# EAGLE schematic Talos_v39 (EAGLE 9.7.0)
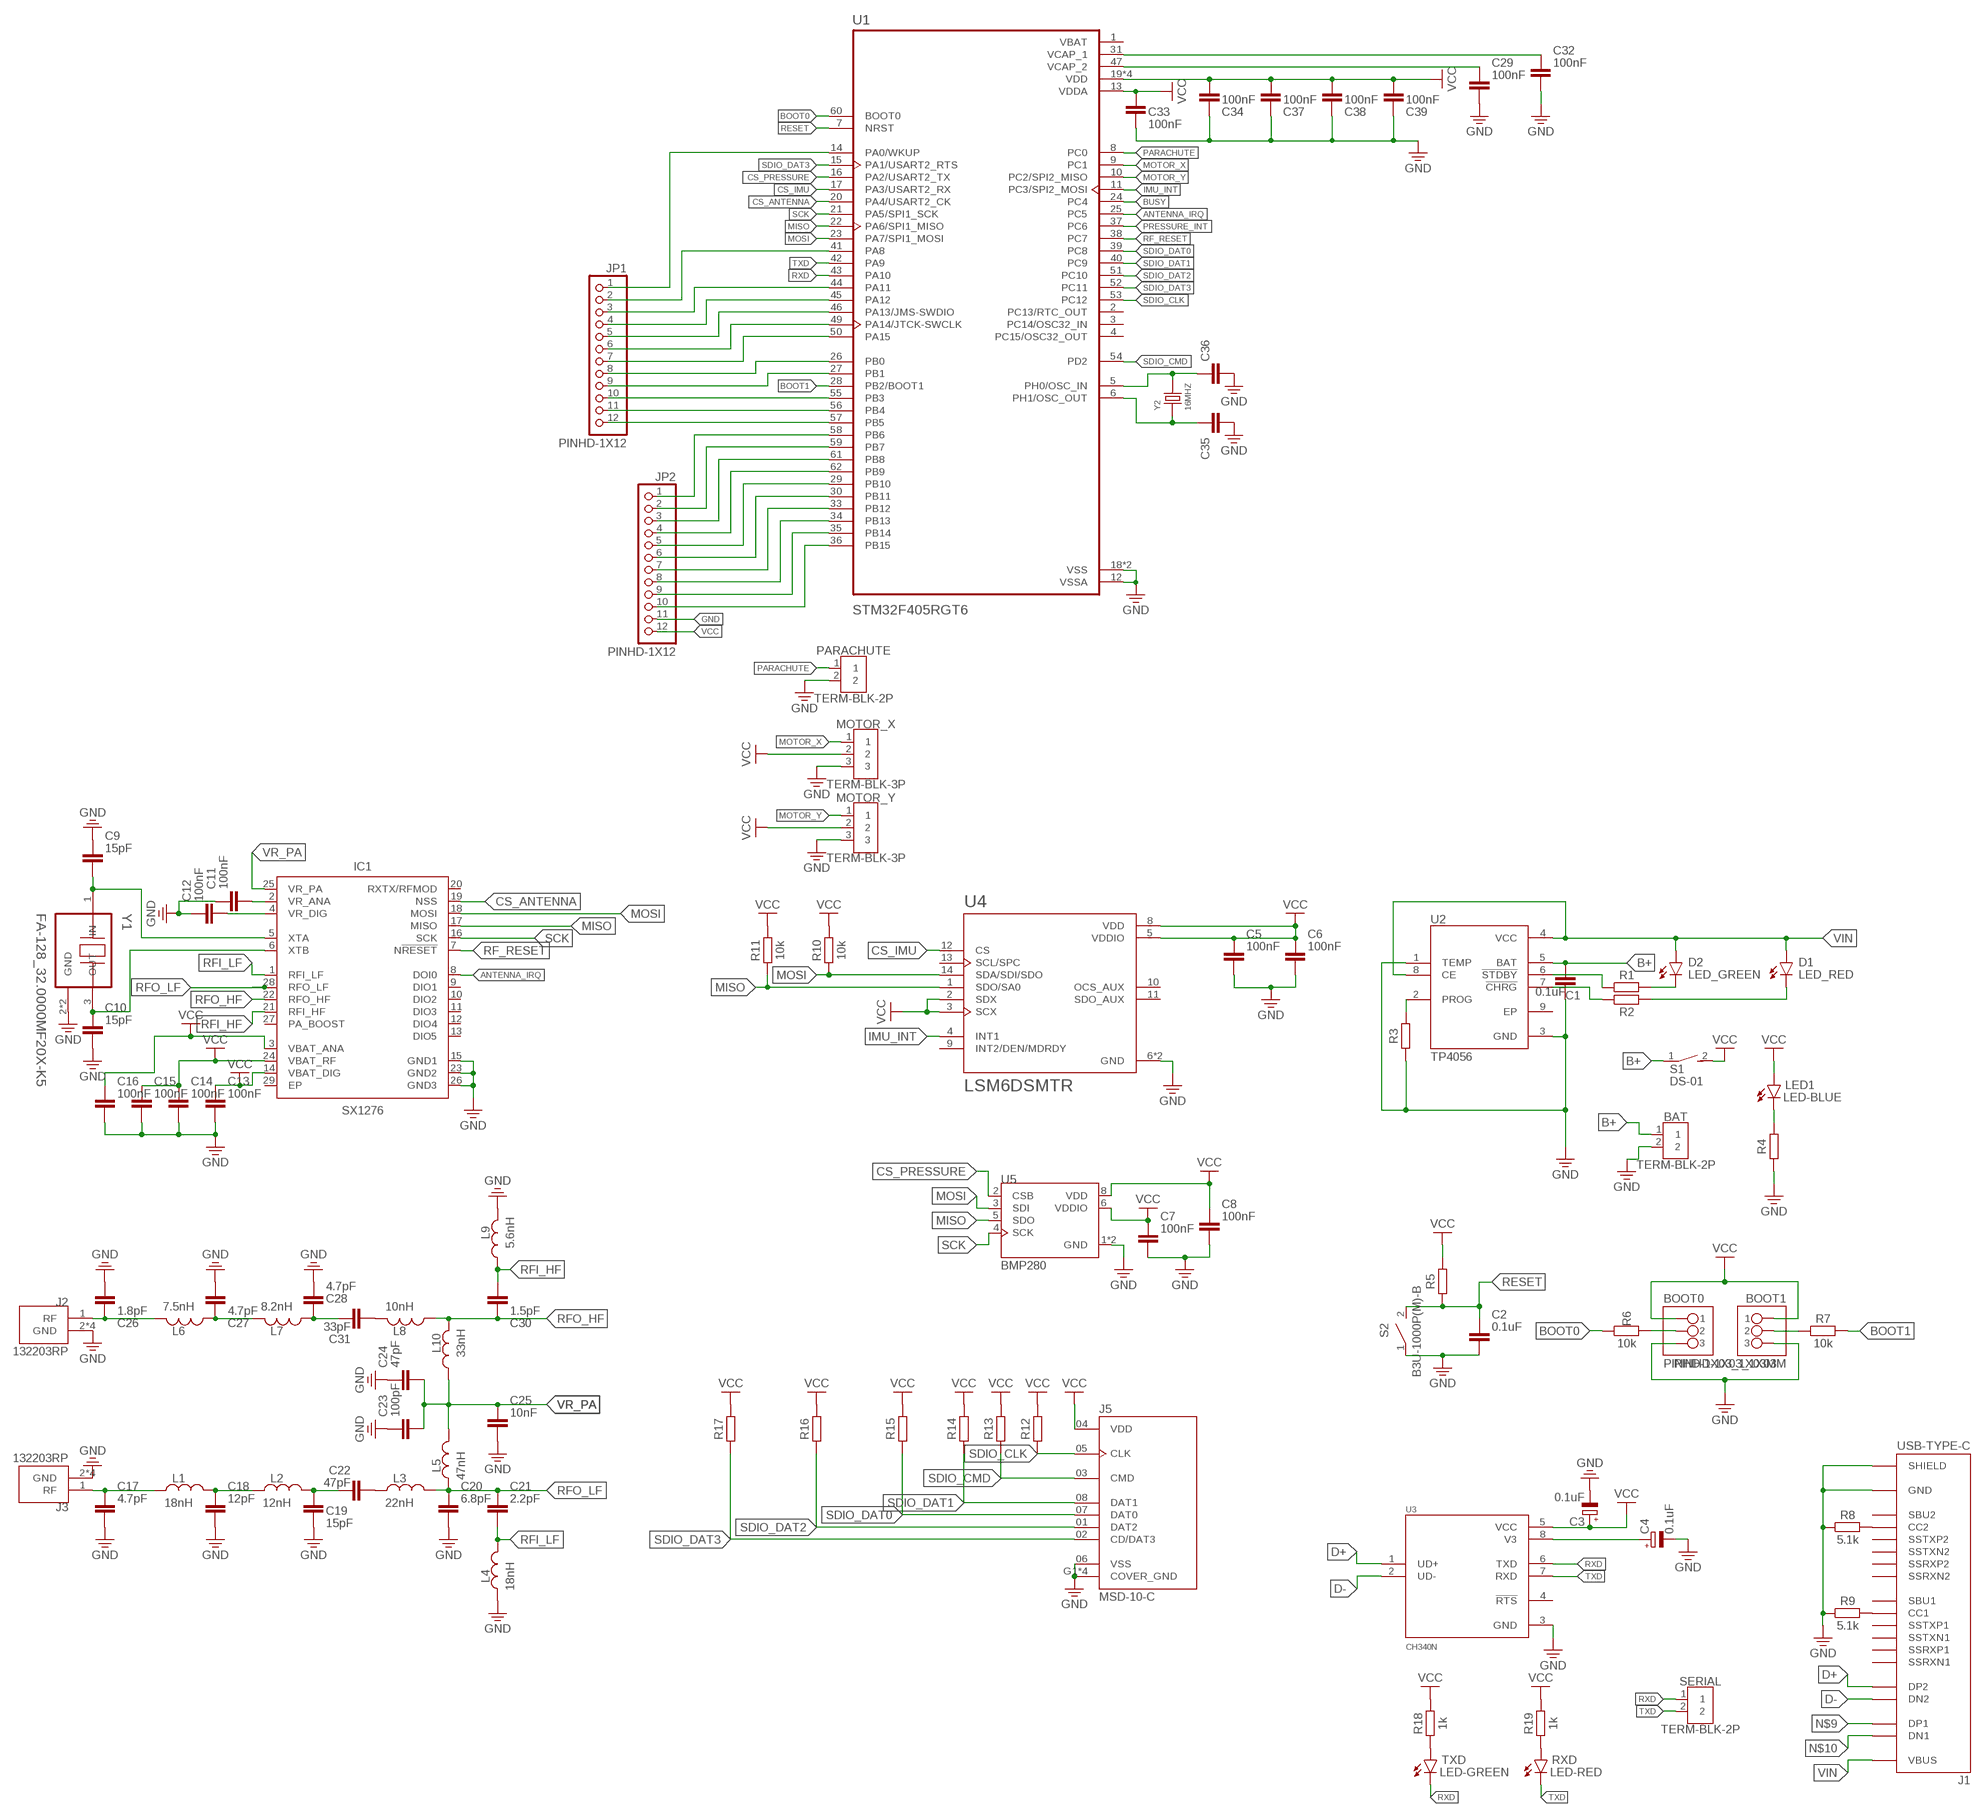
[diagram p0: schematic, sheet 1]

## Parts
BAT  TERM-BLK-2P  2828XX-2282834-2  [TERMBLK_254-2N]
BOOT0  PINHD-1X03_1X03M  [1X03]
BOOT1  PINHD-1X03_1X03M  [1X03]
C1  0.1uF  C_CHIP-0402(1005-METRIC)  [CAPC1005X60]
C2  0.1uF  C_CHIP-0402(1005-METRIC)  [CAPC1005X60]
C3  0.1uF  C-POL_TANTALUM-1206(3216-METRIC)  [CAPMP3216X180N]
C4  0.1uF  C-POL_TANTALUM-1206(3216-METRIC)  [CAPMP3216X180N]
C5  100nF  C_CHIP-0402(1005-METRIC)  [CAPC1005X60]
C6  100nF  C_CHIP-0402(1005-METRIC)  [CAPC1005X60]
C7  100nF  C_CHIP-0402(1005-METRIC)  [CAPC1005X60]
C8  100nF  C_CHIP-0402(1005-METRIC)  [CAPC1005X60]
C9  15pF  C_CHIP-0402(1005-METRIC)  [CAPC1005X60]
C10  15pF  C_CHIP-0402(1005-METRIC)  [CAPC1005X60]
C11  100nF  C_CHIP-0402(1005-METRIC)  [CAPC1005X60]
C12  100nF  C_CHIP-0402(1005-METRIC)  [CAPC1005X60]
C13  100nF  C_CHIP-0402(1005-METRIC)  [CAPC1005X60]
C14  100nF  C_CHIP-0402(1005-METRIC)  [CAPC1005X60]
C15  100nF  C_CHIP-0402(1005-METRIC)  [CAPC1005X60]
C16  100nF  C_CHIP-0402(1005-METRIC)  [CAPC1005X60]
C17  4.7pF  C_CHIP-0402(1005-METRIC)  [CAPC1005X60]
C18  12pF  C_CHIP-0402(1005-METRIC)  [CAPC1005X60]
C19  15pF  C_CHIP-0402(1005-METRIC)  [CAPC1005X60]
C20  6.8pF  C_CHIP-0402(1005-METRIC)  [CAPC1005X60]
C21  2.2pF  C_CHIP-0402(1005-METRIC)  [CAPC1005X60]
C22  47pF  C_CHIP-0402(1005-METRIC)  [CAPC1005X60]
C23  100pF  C_CHIP-0402(1005-METRIC)  [CAPC1005X60]
C24  47pF  C_CHIP-0402(1005-METRIC)  [CAPC1005X60]
C25  10nF  C_CHIP-0402(1005-METRIC)  [CAPC1005X60]
C26  1.8pF  C_CHIP-0402(1005-METRIC)  [CAPC1005X60]
C27  4.7pF  C_CHIP-0402(1005-METRIC)  [CAPC1005X60]
C28  4.7pF  C_CHIP-0402(1005-METRIC)  [CAPC1005X60]
C29  100nF  C_CHIP-0402(1005-METRIC)  [CAPC1005X60]
C30  1.5pF  C_CHIP-0402(1005-METRIC)  [CAPC1005X60]
C31  33pF  C_CHIP-0402(1005-METRIC)  [CAPC1005X60]
C32  100nF  C_CHIP-0402(1005-METRIC)  [CAPC1005X60]
C33  100nF  C_CHIP-0402(1005-METRIC)  [CAPC1005X60]
C34  100nF  C_CHIP-0402(1005-METRIC)  [CAPC1005X60]
C35  C_CHIP-0402(1005-METRIC)  [CAPC1005X60]
C36  C_CHIP-0402(1005-METRIC)  [CAPC1005X60]
C37  100nF  C_CHIP-0402(1005-METRIC)  [CAPC1005X60]
C38  100nF  C_CHIP-0402(1005-METRIC)  [CAPC1005X60]
C39  100nF  C_CHIP-0402(1005-METRIC)  [CAPC1005X60]
D1  LED_RED  CHIP-FLAT-R_0603-0.35MM  [LEDC1608X35N_FLAT-R]
D2  LED_GREEN  CHIP-FLAT-G_0603-0.35MM  [LEDC1608X35N_FLAT-G]
IC1  SX1276  [QFN65P600X600X100-29T480]
J1  USB-TYPE-C  [CUI_UJ31-CH-31-SMT-TR]
J2  132203RP  [132203RP]
J3  132203RP  [132203RP]
J5  MSD-10-C  [CUI_MSD-10-C]
JP1  PINHD-1X12  [1X12]
JP2  PINHD-1X12  [1X12]
L1  18nH  L_CHIP-0402(1006-METRIC)  [INDC1006X60N]
L2  12nH  L_CHIP-0402(1006-METRIC)  [INDC1006X60N]
L3  22nH  L_CHIP-0402(1006-METRIC)  [INDC1006X60N]
L4  18nH  L_CHIP-0402(1006-METRIC)  [INDC1006X60N]
L5  47nH  L_CHIP-0402(1006-METRIC)  [INDC1006X60N]
L6  7.5nH  L_CHIP-0402(1006-METRIC)  [INDC1006X60N]
L7  8.2nH  L_CHIP-0402(1006-METRIC)  [INDC1006X60N]
L8  10nH  L_CHIP-0402(1006-METRIC)  [INDC1006X60N]
L9  5.6nH  L_CHIP-0402(1006-METRIC)  [INDC1006X60N]
L10  33nH  L_CHIP-0402(1006-METRIC)  [INDC1006X60N]
LED1  LED-BLUE  LED_CHIP_BLUE-1608  [LEDC1608X39N_B]
MOTOR_X  TERM-BLK-3P  2828XX-3282834-3  [TERMBLK_254-3N]
MOTOR_Y  TERM-BLK-3P  2828XX-3282834-3  [TERMBLK_254-3N]
PARACHUTE  TERM-BLK-2P  2828XX-2282834-2  [TERMBLK_254-2N]
R1  R_CHIP-0402(1005-METRIC)  [RESC1005X40]
R2  R_CHIP-0402(1005-METRIC)  [RESC1005X40]
R3  RESISTOR__CHIP-0402(1005-METRIC)  [RESC1005X40]
R4  R_CHIP-0402(1005-METRIC)  [RESC1005X40]
R5  R_CHIP-0402(1005-METRIC)  [RESC1005X40]
R6  10k  R_CHIP-0402(1005-METRIC)  [RESC1005X40]
R7  10k  R_CHIP-0402(1005-METRIC)  [RESC1005X40]
R8  5.1k  R_CHIP-0402(1005-METRIC)  [RESC1005X40]
R9  5.1k  R_CHIP-0402(1005-METRIC)  [RESC1005X40]
R10  10k  R_CHIP-0402(1005-METRIC)  [RESC1005X40]
R11  10k  R_CHIP-0402(1005-METRIC)  [RESC1005X40]
R12  R_CHIP-0402(1005-METRIC)  [RESC1005X40]
R13  R_CHIP-0402(1005-METRIC)  [RESC1005X40]
R14  R_CHIP-0402(1005-METRIC)  [RESC1005X40]
R15  R_CHIP-0402(1005-METRIC)  [RESC1005X40]
R16  R_CHIP-0402(1005-METRIC)  [RESC1005X40]
R17  R_CHIP-0402(1005-METRIC)  [RESC1005X40]
R18  1k  R_CHIP-0402(1005-METRIC)  [RESC1005X40]
R19  1k  R_CHIP-0402(1005-METRIC)  [RESC1005X40]
RXD  LED-RED  LED_CHIP_RED-1608  [LEDC1608X39N_R]
S1  DS-01  DS01E  [DS-01]
S2  B3U-1000P(M)-B  B3U-X000B3U-1000P(M)-B1000P(M)-B  [B3U-1000P(M)-B]
SERIAL  TERM-BLK-2P  2828XX-2282834-2  [TERMBLK_254-2N]
TXD  LED-GREEN  LED_CHIP_GREEN-1608  [LEDC1608X39N_G]
U1  STM32F405RGT6  [QFP50P1200X1200X160-64N]
U2  TP4056  [SOP127P600X175-9N]
U3  CH340N  [SOIC127P600X160-8N]
U4  LSM6DSMTR  [PQFN50P300X250X86-14N]
U5  BMP280  [XDCR_BMP280]
Y1  FA-128_32.0000MF20X-K5  [OSCCC200X160X50]
Y2  16MHZ  DIP-CRYSTAL-16MHZ-18PF-30PPM-40R(HC49US)  [HC49US]

## Nets
ANTENNA_IRQ: IC1.8(DOI0) U1.25(PC5)
B+: BAT.1 C1.2 S1.1 U2.5(BAT)
BOOT0: R6.1 U1.60(BOOT0)
BOOT1: R7.2 U1.28(PB2/BOOT1)
BUSY: U1.24(PC4)
CS_ANTENNA: IC1.19(NSS) U1.20(PA4/USART2_CK)
CS_IMU: U1.17(PA3/USART2_RX) U4.12(CS)
CS_PRESSURE: U1.16(PA2/USART2_TX) U5.2(CSB)
D+: J1.B6(DP2) U3.1(UD+)
D-: J1.B7(DN2) U3.2(UD-)
GND: BAT.2 BOOT0.3 BOOT1.3 C1.1 C2.2 C3.2(-) C4.2(-) C5.2 C6.2 C7.2 C8.2 C9.1 C10.2 C11.1 C12.1 C13.2 C14.2 C15.2 C16.2 C17.2 C18.2 C19.2 C20.2 C23.1 C24.1 C25.2 C26.2 C27.2 C28.2 C29.2 C32.2 C33.2 C34.2 C35.2 C36.2 C37.2 C38.2 C39.2 IC1.15(GND1) IC1.23(GND2) IC1.26(GND3) J1.1(SHIELD) J1.2(SHIELD) J1.3(SHIELD) J1.4(SHIELD) J1.5(SHIELD) J1.6(SHIELD) J1.A1(GND) J1.A12(GND) J1.B1(GND) J1.B12(GND) J1.S1(SHIELD) J1.S2(SHIELD) J2.2(GND) J2.3(GND) J2.4(GND) J2.5(GND) J3.2(GND) J3.3(GND) J3.4(GND) J3.5(GND) J5.06(VSS) J5.G1(COVER_GND) J5.G2(COVER_GND) J5.G3(COVER_GND) J5.G4(COVER_GND) JP2.11 L4.1 L9.1 MOTOR_X.3 MOTOR_Y.3 PARACHUTE.2 R3.1 R4.1 R8.1 R9.1 S2.1 U1.12(VSSA) U1.18(VSS) U1.63(VSS) U2.1(TEMP) U2.3(GND) U3.3(GND) U4.6(GND) U4.7(GND) U5.1(GND) U5.7(GND) Y1.2(GND) Y1.4(GND)
IMU_INT: U1.11(PC3/SPI2_MOSI) U4.4(INT1)
MISO: IC1.17(MISO) R11.1 U1.22(PA6/SPI1_MISO) U4.1(SDO/SA0) U5.5(SDO)
MOSI: IC1.18(MOSI) R10.1 U1.23(PA7/SPI1_MOSI) U4.14(SDA/SDI/SDO) U5.3(SDI)
MOTOR_X: MOTOR_X.1 U1.9(PC1)
MOTOR_Y: MOTOR_Y.1 U1.10(PC2/SPI2_MISO)
N$1: D2.C R1.2
N$2: D1.C R2.2
N$3: R1.1 U2.6(!STDBY)
N$4: R2.1 U2.7(!CHRG)
N$5: R3.2 U2.2(PROG)
N$6: LED1.1(C) R4.2
N$7: BOOT0.2 R6.2
N$8: BOOT1.2 R7.1
N$9: J1.A6(DP1)
N$10: J1.A7(DN1)
N$11: J1.B5(CC2) R8.2
N$12: C4.1(+) U3.8(V3)
N$13: J1.A5(CC1) R9.2
N$14: JP1.1 U1.14(PA0/WKUP)
N$15: JP1.2 U1.41(PA8)
N$16: C9.2 IC1.5(XTA) Y1.1(IN)
N$17: C10.1 IC1.6(XTB) Y1.3(OUT)
N$18: C11.2 IC1.2(VR_ANA)
N$19: C12.2 IC1.4(VR_DIG)
N$20: C17.1 J3.1(RF) L1.1
N$21: C18.1 L1.2 L2.1
N$22: C19.1 C22.1 L2.2
N$23: C26.1 J2.1(RF) L6.1
N$24: C27.1 L6.2 L7.1
N$25: C22.2 L3.1
N$26: C28.1 C31.1 L7.2
N$27: C31.2 L8.1
N$28: C32.1 U1.31(VCAP_1)
N$29: C29.1 U1.47(VCAP_2)
N$30: JP1.3 U1.44(PA11)
N$31: JP1.4 U1.45(PA12)
N$32: JP1.5 U1.46(PA13/JMS-SWDIO)
N$33: JP1.6 U1.49(PA14/JTCK-SWCLK)
N$34: JP1.7 U1.50(PA15)
N$35: JP1.8 U1.26(PB0)
N$36: JP1.9 U1.27(PB1)
N$37: JP1.10 U1.55(PB3)
N$38: JP1.11 U1.56(PB4)
N$39: JP1.12 U1.57(PB5)
N$40: JP2.1 U1.58(PB6)
N$41: JP2.2 U1.59(PB7)
N$42: JP2.3 U1.61(PB8)
N$43: JP2.4 U1.62(PB9)
N$44: JP2.5 U1.29(PB10)
N$45: JP2.6 U1.30(PB11)
N$46: JP2.7 U1.33(PB12)
N$47: JP2.8 U1.34(PB13)
N$48: JP2.9 U1.35(PB14)
N$49: JP2.10 U1.36(PB15)
N$50: R19.1 RXD.2(A)
N$51: R18.1 TXD.2(A)
OSC_IN: C36.1 U1.5(PH0/OSC_IN) Y2.2
OSC_OUT: C35.1 U1.6(PH1/OSC_OUT) Y2.1
PARACHUTE: PARACHUTE.1 U1.8(PC0)
PRESSURE_INT: U1.37(PC6)
RESET: C2.1 R5.1 S2.2 U1.7(NRST)
RF_RESET: IC1.7(N!RESET!) U1.38(PC7)
RFI_HF: C30.2 IC1.21(RFI_HF) L9.2
RFI_LF: C21.2 IC1.1(RFI_LF) L4.2
RFO_HF: C30.1 IC1.22(RFO_HF) L8.2 L10.1
RFO_LF: C20.1 C21.1 IC1.28(RFO_LF) L3.2 L5.1
RXD: SERIAL.1 TXD.1(C) U1.43(PA10) U3.6(TXD)
SCK: IC1.16(SCK) U1.21(PA5/SPI1_SCK) U5.4(SCK)
SDIO_CLK: J5.05(CLK) R12.1 U1.53(PC12)
SDIO_CMD: J5.03(CMD) R13.1 U1.54(PD2)
SDIO_DAT0: J5.07(DAT0) R15.1 U1.39(PC8)
SDIO_DAT1: J5.08(DAT1) R14.1 U1.40(PC9)
SDIO_DAT2: J5.01(DAT2) R16.1 U1.51(PC10)
SDIO_DAT3: J5.02(CD/DAT3) R17.1 U1.15(PA1/USART2_RTS) U1.52(PC11)
TXD: RXD.1(C) SERIAL.2 U1.42(PA9) U3.7(RXD)
VCC: BOOT0.1 BOOT1.1 C3.1(+) C5.1 C6.1 C7.1 C8.1 C13.1 C14.1 C15.1 C16.1 C33.1 C34.1 C37.1 C38.1 C39.1 IC1.3(VBAT_ANA) IC1.14(VBAT_DIG) IC1.24(VBAT_RF) J5.04(VDD) JP2.12 LED1.2(A) MOTOR_X.2 MOTOR_Y.2 R5.2 R10.2 R11.2 R12.2 R13.2 R14.2 R15.2 R16.2 R17.2 R18.2 R19.2 S1.2 U1.13(VDDA) U1.19(VDD) U1.32(VDD) U1.48(VDD) U1.64(VDD) U3.5(VCC) U4.2(SDX) U4.3(SCX) U4.5(VDDIO) U4.8(VDD) U5.6(VDDIO) U5.8(VDD)
VIN: D1.A D2.A J1.A4(VBUS) J1.A9(VBUS) J1.B4(VBUS) J1.B9(VBUS) U2.4(VCC) U2.8(CE)
VR_PA: C23.2 C24.2 C25.1 IC1.25(VR_PA) L5.2 L10.2
Unconnected: IC1.9(DIO1) IC1.10(DIO2) IC1.11(DIO3) IC1.12(DIO4) IC1.13(DIO5) IC1.20(RXTX/RFMOD) IC1.27(PA_BOOST) IC1.29(EP) J1.A2(SSTXP1) J1.A3(SSTXN1) J1.A8(SBU1) J1.A10(SSRXN2) J1.A11(SSRXP2) J1.B2(SSTXP2) J1.B3(SSTXN2) J1.B8(SBU2) J1.B10(SSRXN1) J1.B11(SSRXP1) U1.2(PC13/RTC_OUT) U1.3(PC14/OSC32_IN) U1.4(PC15/OSC32_OUT) U2.9(EP) U3.4(!RTS) U4.9(INT2/DEN/MDRDY) U4.10(OCS_AUX) U4.11(SDO_AUX) U4.13(SCL/SPC)

## Power pins joined to a net without a drawn wire
VBAT: U1.1(VBAT)

## Library data of the parts
BAT PARACHUTE SERIAL = Connector:2828XX-2: 2 Position Wire to Board Terminal Block Horizontal with Board Datasheet <https://www.te.com.cn/commerce/DocumentDelivery/DDEController?Action=showdoc&DocId=Catalog+Section%7F1308389_EUROSTYLE_TERMINAL_BLOCKS%7F0607%7Fpdf%7FEnglish%7FENG_CS_1308389_EUROSTYLE_TERMINAL_BLOCKS_0607.pdf%7F2-282837-5>; CATEGORY: Fixed Terminal Blocks; DESCRIPTION: Fixed Terminal Blocks 2P SIDE ENTRY 2.54mm; MANUFACTURER: TE Connectivity AMP Connectors; MPN: 282834-2; OPERATING_TEMPERATURE: -40°C ~ 105°C; PART_STATUS: Active; PITCH: 0.100" (2.54mm); ROHS_COMPLIANCE: RoHS Compliant; SERIES: Buchanan; SUBCATEGORY: Terminal Blocks; TYPE: Through Hole; Screw - Rising Cage Clamp; Side wire entry, Horizontal with Board
BOOT0 BOOT1 = Tinkercad:PINHD-1X03
C1 C2 C5-C39 = Capacitor:C: Capacitor - Generic; CATEGORY: Capacitor
C3 C4 = Capacitor:C-POL: Capacitor Polarised - Generic; CATEGORY: Capacitor
D1 = LED:CHIP-FLAT-R; CATEGORY: LED; COLOR: RED; DESCRIPTION: CHIP LED FLAT; SUB-CATEGORY: CHIP; TYPE: FLAT_TOP
D2 = LED:CHIP-FLAT-G; CATEGORY: LED; COLOR: GREEN; DESCRIPTION: CHIP LED FLAT; SUB-CATEGORY: CHIP; TYPE: FLAT_TOP
IC1 = IC_Wireless-RF:SX127*: SX1276/77/79 - 137 MHz to 1020 MHz Low Power Long Range Transceiver Datasheet <https://semtech.my.salesforce.com/sfc/p/#E0000000JelG/a/2R0000001Rbr/6EfVZUorrpoKFfvaF_Fkpgp5kzjiNyiAbqcpqh9qSjE> Product Page <https://www.semtech.com/products/wireless-rf/lora-core/sx1276>; CATEGORY: IC_Wireless-RF; DESCRIPTION: IC RF TXRX 802.15.4 28VQFN; FREQUENCY: 137 - 1020 MHz; MANUFACTURER: Semtech; MPN: SX1276IMLTRT; OPERATING_TEMP: -40°C to 85°C; PART_STATUS: Active; SERIES: SX1276; SUB-CATEGORY: Transceiver; TYPE: LoRa Core™
J1 = SnapEDA Library:USB-TYPE-C: Type C, USB 3.1 Gen 2, 5 A, Right Angle, Surface Mount (SMT), USB Receptacle; MANUFACTURER: CUI Devices; MAXIMUM_PACKAGE_HEIGHT: 3.21 mm; PARTREV: 1.03; STANDARD: Manufacturer Recommendations
J2 J3 = SnapEDA Library:132203RP: Conn; RF; SMA Rt Angle PCB Jack Thru Hole 50 Ohm Bulkhead Reverse Polarized; MANUFACTURER: AMPHENOL CONEXX; PARTREV: C; STANDARD: Manufacturer recommendations
J5 = SnapEDA Library:MSD-10-C; MANUFACTURER: CUI Devices; MAXIMUM_PACKAGE_HEIGHT: 2.07mm; PARTREV: 1.0; STANDARD: Manufacturer Recommendations
JP1 JP2 = Connector:PINHD-1X12: PIN HEADER; CATEGORY: Headers; DESCRIPTION: Header, Straight, 12 Position; MANUFACTURER: Generic; MPN: Generic; OPERATING_TEMPERATURE: Generic; PART_STATUS: Active; PITCH: 0.100" (2.54mm); ROHS_COMPLIANCE: Generic; SERIES: Generic; SUB-CATEGORY: Headers, Male Pins; TYPE: Board to Board or Cable, Unshrouded, Through Hole, Straight
L1-L10 = Inductor:L: Inductor Fixed - Generic; CATEGORY: Inductor; SUB-CATEGORY: Fixed
LED1 = Tutorial - Fusion 360:LED_CHIP: LED - Generic; CATEGORY: Opto-Electronic; COLOR: Blue; SUB-CATEGORY: LED
MOTOR_X MOTOR_Y = Connector:2828XX-3: 3 Position Wire to Board Terminal Block Horizontal with Board Datasheet <https://www.te.com.cn/commerce/DocumentDelivery/DDEController?Action=showdoc&DocId=Catalog+Section%7F1308389_EUROSTYLE_TERMINAL_BLOCKS%7F0607%7Fpdf%7FEnglish%7FENG_CS_1308389_EUROSTYLE_TERMINAL_BLOCKS_0607.pdf%7F2-282837-5>; CATEGORY: Fixed Terminal Blocks; DESCRIPTION: Fixed Terminal Blocks 3P TERMINAL BLOCK; MANUFACTURER: TE Connectivity AMP Connectors; MPN: 282834-3; OPERATING_TEMPERATURE: -40°C ~ 105°C; PART_STATUS: Active; PITCH: 0.100" (2.54mm); ROHS_COMPLIANCE: RoHS Compliant; SERIES: Buchanan; SUBCATEGORY: Terminal Blocks; TYPE: Through Hole; Screw - Rising Cage Clamp; Side wire entry, Horizontal with Board
R1 R2 R4-R19 = Resistor:R: Resistor Fixed - Generic; CATEGORY: Resistor; SUB-CATEGORY: Fixed
R3 = Tinkercad:RESISTOR: Resistor Fixed - Generic; CATEGORY: Resistor; SUB-CATEGORY: Fixed
RXD = Tutorial - Fusion 360:LED_CHIP: LED - Generic; CATEGORY: Opto-Electronic; COLOR: Red; SUB-CATEGORY: LED
S1 = Switch:DS01E: DIL/CODE SWITCH; CATEGORY: SWITCH; TYPE: SPST
S2 = Switch:B3U-X000: Ultra-small Tactile Switch Contact form : SPST-NO Datasheet <https://omronfs.omron.com/en_US/ecb/products/pdf/en-b3u.pdf>; CATEGORY: SWITCH; DESCRIPTION: Ultra-small Surface-mounting Tactile Switches with High Contact Reliability; MANUFACTURER: OMRON; OPERATING_TEMPERATURE: -25°C to +70°C at 60%RH max; PART_STATUS: ACTIVE; SERIES: B3U; TYPE: Tactile
TXD = Tutorial - Fusion 360:LED_CHIP: LED - Generic; CATEGORY: Opto-Electronic; COLOR: Green; SUB-CATEGORY: LED
U1 = SnapEDA Library:STM32F405RGT6: High-performance foundation line, ARM Cortex-M4 core with DSP and FPU, 1 Mbyte Flash, 168 MHz CPU, ART Accelerator; MANUFACTURER: STMicroelectronics; PARTREV: LTR; STANDARD: IPC-7351B
U2 = SnapEDA Library:TP4056: Complete single cell Li-Ion battery with a constant current / constant voltage linear charger; MANUFACTURER: NanJing Top Power ASIC Corp.; MAXIMUM_PACKAGE_HEIGHT: 1.75mm; STANDARD: IPC 7351B
U3 = SnapEDA Library:CH340N; MANUFACTURER: WCH; MAXIMUM_PACKAGE_HEIGHT: 1.6mm; PARTREV: V3C; STANDARD: IPC 7351B
U4 = SnapEDA Library:LSM6DSMTR: iNEMO inertial module: 3D accelerometer and 3D gyroscope; MANUFACTURER: STMicroelectronics; MAXIMUM_PACKAGE_HEIGHT: 0.86 mm; PARTREV: Rev 7; STANDARD: IPC 7351B
U5 = SnapEDA Library:BMP280: BMP280 Absolute Barometric Pressure Sensor for Battery Powered Devices 2 x 2.5mm; MANUFACTURER: Bosch; MP: BMP280; PART_REV: 1.19; STANDARD: MANUFACTURER RECOMMENDATIONS
Y1 = SnapEDA Library:FA-128_32.0000MF20X-K5: CRYSTAL 32MHZ 10PF SMD; AVAILABILITY: Good; DESCRIPTION: CRYSTAL 32MHZ 10PF SMD; MF: EPSON; MP: FA-128 32.0000MF20X-K5; PACKAGE: SMD-4 Epson; PRICE: 0.51 USD; STANDARD: IPC-7351B
Y2 = OPL_Crystal Oscillator:DIP-CRYSTAL-16MHZ-18PF-30PPM-40R(HC49US): 306010014; MPN: HC-49US 16.000MHz